# Altium schematic sheet jtag.SchDoc
size A4; SheetNumber: 3; SheetTotal: 5
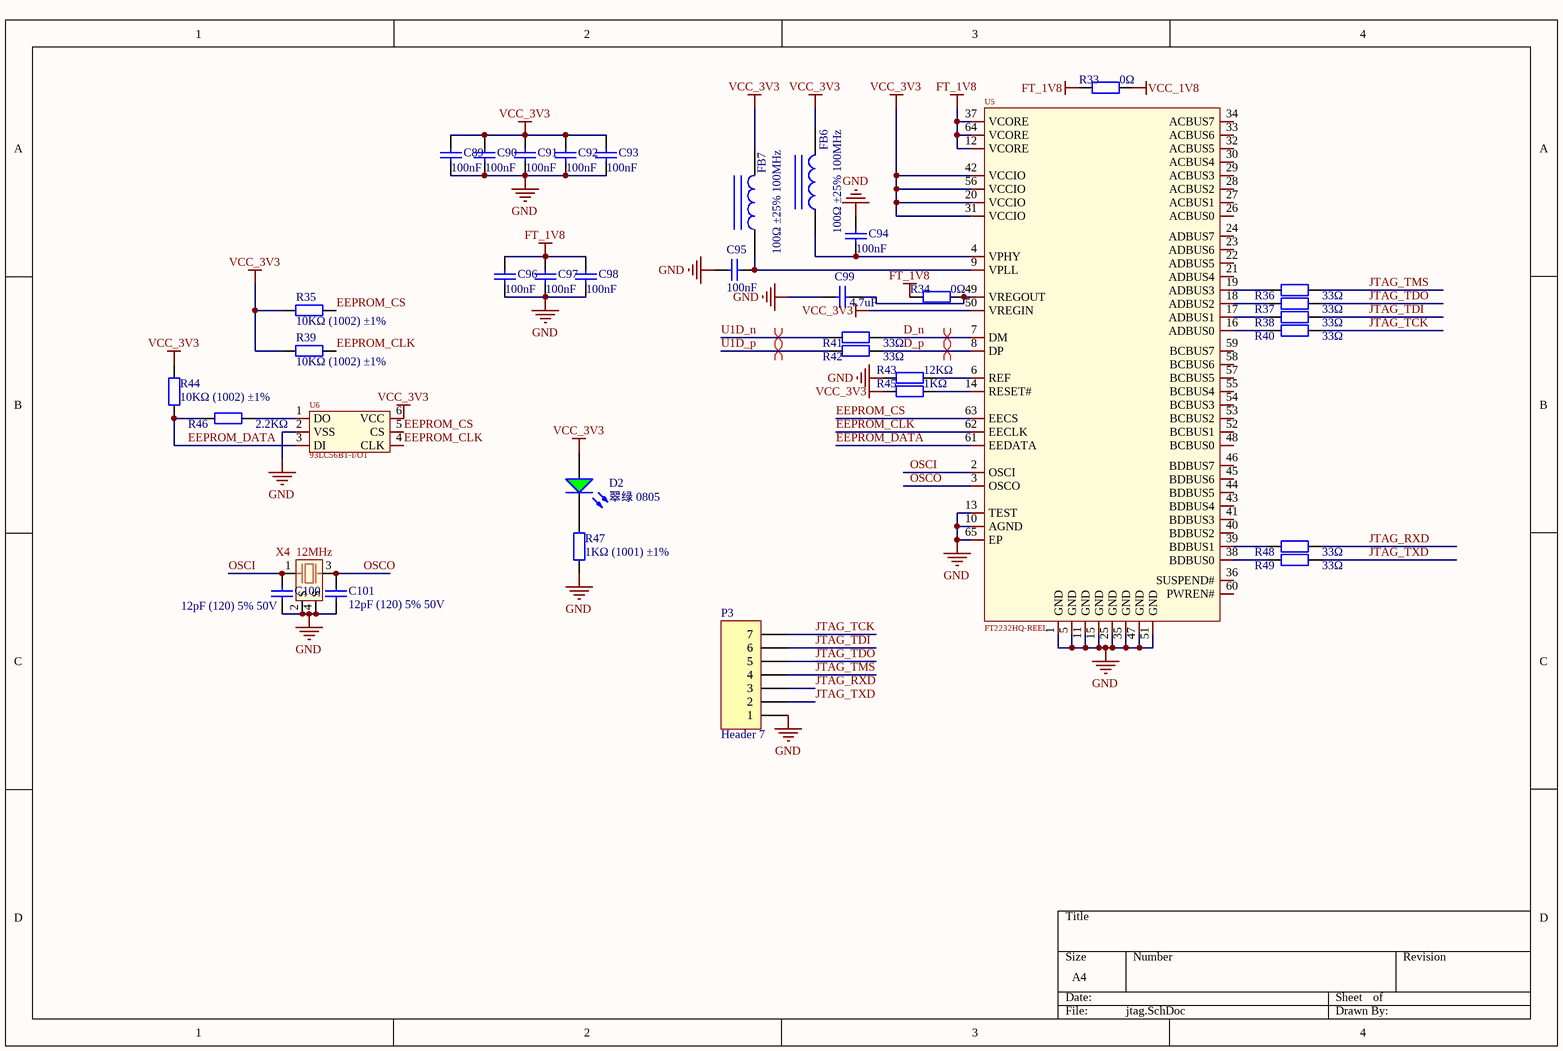
[diagram p0: jtag.SchDoc]

## Parts
C89  100nF  [0402_C]
C90  100nF  [0402_C]
C91  100nF  [0402_C]
C92  100nF  [0402_C]
C93  100nF  [0402_C]
C94  100nF  [0402_C]
C95  100nF  [0402_C]
C96  100nF  [0402_C]
C97  100nF  [0402_C]
C98  100nF  [0402_C]
C99  4.7uF  [0402_C]
C100  12pF (120) 5% 50V  [0402_C]
C101  12pF (120) 5% 50V  [0402_C]
D2  翠绿 0805  [0805_LED_S1]
FB6  100Ω ±25% 100MHz  [0805_L]
FB7  100Ω ±25% 100MHz  [0805_L]
P3  Header 7  [HDR1X7]
R33  0Ω  [0402_R]
R34  0Ω  [0402_R]
R35  10KΩ (1002) ±1%  [0402_R]
R36  33Ω  [0402]
R37  33Ω  [0402]
R38  33Ω  [0402]
R39  10KΩ (1002) ±1%  [0402_R]
R40  33Ω  [0402]
R41  33Ω  [0402_R]
R42  33Ω  [0402_R]
R43  12KΩ  [0402_R]
R44  10KΩ (1002) ±1%  [0402_R]
R45  1KΩ  [0402_R]
R46  2.2KΩ  [0402_R]
R47  1KΩ (1001) ±1%  [0805_R]
R48  33Ω  [0402]
R49  33Ω  [0402]
U5  FT2232HQ-REEL  [QFN-64_L9.0-W9.0-P0.50-TL-EP4.3]
U6  93LC56BT-I/OT  [SOT-23-6_L2.9-W1.6-P0.95-LS2.8-BR]
X4  12MHz  [3225]

## Nets
FT_1V8: C96.2 C97.2 C98.2 R33.1 R34.1 U5.12(VCORE) U5.37(VCORE) U5.64(VCORE)
GND: C89.1 C90.1 C91.1 C92.1 C93.1 C94.2 C95.2 C96.1 C97.1 C98.1 C99.1 C100.1 C101.1 P3.1 R43.1 R47.1 U5.1(GND) U5.5(GND) U5.10(AGND) U5.11(GND) U5.13(TEST) U5.15(GND) U5.25(GND) U5.35(GND) U5.47(GND) U5.51(GND) U5.65(EP) U6.2(VSS) X4.2(S) X4.4(S)
VCC_1V8: R33.2
VCC_3V3: C89.2 C90.2 C91.2 C92.2 C93.2 D2.A FB6.2 FB7.2 R35.2 R39.2 R44.2 R45.1 U5.20(VCCIO) U5.31(VCCIO) U5.42(VCCIO) U5.50(VREGIN) U5.56(VCCIO) U6.6(VCC)
D_n: R41.2 U5.7(DM)
D_p: R42.2 U5.8(DP)
EEPROM_CLK: R39.1 U5.62(EECLK) U6.4(CLK)
EEPROM_CS: R35.1 U5.63(EECS) U6.5(CS)
EEPROM_DATA: R44.1 R46.1 U5.61(EEDATA) U6.3(DI)
JTAG_RXD: P3.3 R48.2
JTAG_TCK: P3.7 R40.2
JTAG_TDI: P3.6 R38.2
JTAG_TDO: P3.5 R37.2
JTAG_TMS: P3.4 R36.2
JTAG_TXD: P3.2 R49.2
OSCI: C100.2 U5.2(OSCI) X4.1
OSCO: C101.2 U5.3(OSCO) X4.3
U1D_n: R41.1
U1D_p: R42.1
NetC94_1: C94.1 FB6.1 U5.4(VPHY)
NetC95_1: C95.1 FB7.1 U5.9(VPLL)
NetC99_2: C99.2 R34.2 U5.49(VREGOUT)
NetD2_K: D2.K R47.2
NetR36_1: R36.1 U5.19(ADBUS3)
NetR37_1: R37.1 U5.18(ADBUS2)
NetR38_1: R38.1 U5.17(ADBUS1)
NetR40_1: R40.1 U5.16(ADBUS0)
NetR43_2: R43.2 U5.6(REF)
NetR45_2: R45.2 U5.14(RESET#)
NetR46_2: R46.2 U6.1(DO)
NetR48_1: R48.1 U5.39(BDBUS1)
NetR49_1: R49.1 U5.38(BDBUS0)

Not connected (* = marked no-connect by the designer): U5 21(ADBUS4) 22(ADBUS5) 23(ADBUS6) 24(ADBUS7) 26(ACBUS0) 27(ACBUS1) 28(ACBUS2) 29(ACBUS3) 30(ACBUS4) 32(ACBUS5) 33(ACBUS6) 34(ACBUS7) 36(SUSPEND#) 40(BDBUS2) 41(BDBUS3) 43(BDBUS4) 44(BDBUS5) 45(BDBUS6) 46(BDBUS7) 48(BCBUS0) 52(BCBUS1) 53(BCBUS2) 54(BCBUS3) 55(BCBUS4) 57(BCBUS5) 58(BCBUS6) 59(BCBUS7) 60(PWREN#)

## Layout directives
differential pair: D_n, D_p, U1D_n, U1D_p

## Library data of the parts
C89-C98 = 0805 100nF(104) 10% 50V: 贴片电容; ComponentLink1Description: 供应商链接; ComponentLink1URL: http://www.szlcsc.com/product/details_50686.html; Package: 0805; Supplier: LC; SuppliersPartNumber: C49678
C99 = 0805 4.7uF (475) 10% 25V: 贴片电容; ComponentLink1Description: 供应商链接; ComponentLink1URL: http://www.szlcsc.com/product/details_2131.html; Package: 0805; Supplier: LC; SuppliersPartNumber: C1779
C100 C101 = 0805 12pF (120) 5% 50V: 贴片电容; ComponentLink1Description: 供应商链接; ComponentLink1URL: http://www.szlcsc.com/product/details_2144.html; Package: 0805; Supplier: LC; SuppliersPartNumber: C1792
D2 = 0805 翠绿: 发光二极管; ComponentLink1Description: 供应商链接; ComponentLink1URL: http://www.szlcsc.com/product/details_2670.html; Package: 0805; Supplier: LC; SuppliersPartNumber: C2297
FB6 FB7 = 0805 100Ω 25% 100MHz: 贴片磁珠; ComponentLink1Description: 供应商链接; ComponentLink1URL: http://www.szlcsc.com/product/details_1367.html; Package: 0805; Supplier: LC; SuppliersPartNumber: C1015
P3 = Header 7: Header, 7-Pin; LatestRevisionDate: 17-Jul-2002; LatestRevisionNote: Re-released for DXP Platform.; Publisher: Altium Limited
R33 R34 = 0402 0Ω (0R0) 1%: 贴片电阻; ComponentLink1Description: 供应商链接; ComponentLink1URL: http://www.szlcsc.com/product/details_17853.html; Package: 0402; Supplier: LC; SuppliersPartNumber: C17168
R35 R39 R44 = 0805 10KΩ (1002) 1%: 贴片电阻; ComponentLink1Description: 供应商链接; ComponentLink1URL: http://www.szlcsc.com/product/details_18102.html; Package: 0805; Supplier: LC; SuppliersPartNumber: C17414
R36-R38 R40-R42 R48 R49 = 0805 33Ω (33R0) 1%: 贴片电阻; ComponentLink1Description: 供应商链接; ComponentLink1URL: http://www.szlcsc.com/product/details_18322.html; Package: 0805; Supplier: LC; SuppliersPartNumber: C17634
R43 = 0805 12KΩ (1202) 1%: 贴片电阻; ComponentLink1Description: 供应商链接; ComponentLink1URL: http://www.szlcsc.com/product/details_18132.html; Package: 0805; Supplier: LC; SuppliersPartNumber: C17444
R45 R47 = 0805 1KΩ (1001) 1%: 贴片电阻; ComponentLink1Description: 供应商链接; ComponentLink1URL: http://www.szlcsc.com/product/details_18201.html; Package: 0805; Supplier: LC; SuppliersPartNumber: C17513
R46 = 0805 2.2KΩ (2201) 1%: 贴片电阻; ComponentLink1Description: 供应商链接; ComponentLink1URL: http://www.szlcsc.com/product/details_18208.html; Package: 0805; Supplier: LC; SuppliersPartNumber: C17520
U5 = FT2232HQ-REEL: Manufacturer: FTDI(飞特帝亚); Add into BOM: yes; Applications Function: USB转UART；USB转FIFO; Supply Voltage: 3V~3.6V; Symbol: FT2232HQ-REEL; Device: FT2232HQ-REEL; LCSC Part Name: FT2232H 双高速 USB 转多用途 UART/FIFO IC; Supplier Part: C193662; Manufacturer Part: FT2232HQ-REEL; Supplier Footprint: QFN-64-EP(9x9); JLCPCB Part Class: Extended Part; Datasheet: https://atta.szlcsc.com/upload/public/pdf/source/20180530/C193662_F14B45A4B5271BE746E436B0F2E041EE.pdf; Supplier: LCSC; Convert to PCB: yes; Protocol: -; Operating Temperature: -40℃~+85℃
U6 = 93LC56BT-I/OT: Manufacturer: MICROCHIP(美国微芯); Add into BOM: yes; Interface Type: SPI; Memory Size: 2Kbit; Supply Voltage: 2.5V~5.5V; Write Cycle Time (Tw): 6ms; Data Retention - TDR (Year): 200年; Write Cycle Endurance: 1000000次; Symbol: 93LC56BT-I/OT; Device: 93LC56BT-I/OT; LCSC Part Name: 93LC56BT-I/OT; Supplier Part: C190271; Manufacturer Part: 93LC56BT-I/OT; Supplier Footprint: SOT-23-6; JLCPCB Part Class: Extended Part; Datasheet: https://atta.szlcsc.com/upload/public/pdf/source/20140724/1457707164359.pdf; Supplier: LCSC; Convert to PCB: yes; Operating Temperature: -40℃~+85℃
X4 = 四脚无源晶体: 4脚贴片无源晶体; Manufacturer: YJX(雅晶鑫); Symbol: TAXM8M4RDBCCT2T; Add into BOM: yes; Value: 8MHz; Normal temperature Frequency Tolerance: ±10ppm; Load Capacitance: 10pF; Frequency Stability: ±15ppm; Equivalent Series Resistance(ESR): 250Ω; Device: TAXM8M4RDBCCT2T; LCSC Part Name: 8MHz ±10ppm 10pF; Supplier Part: C400090; Manufacturer Part: TAXM8M4RDBCCT2T; Supplier Footprint: SMD3225-4P; JLCPCB Part Class: Extended Part; Datasheet: https://atta.szlcsc.com/upload/public/pdf/source/20190626/C400090_CF95B89E745AFE4EF2E392EF8AC009D6.pdf; Supplier: LCSC; Convert to PCB: yes; Type: 贴片晶振; Operating Temperature: -40℃~+85℃